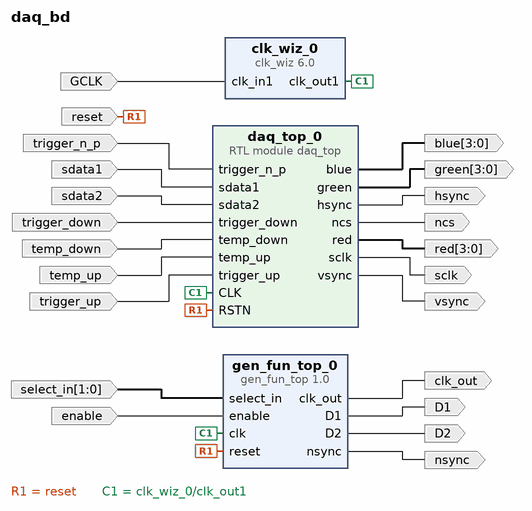
[diagram p0: block diagram of the top level]
# Vivado block design daq_bd, xc7z020clg484-1, Vivado 2020.2
create_bd_design daq_bd

create_bd_port -dir I sdata1
create_bd_port -dir I sdata2
create_bd_port -dir O ncs
create_bd_port -dir O sclk
create_bd_port -dir O nsync
create_bd_port -dir O D1
create_bd_port -dir O D2
create_bd_port -dir O clk_out
create_bd_port -dir O -from 3 -to 0 red
create_bd_port -dir O -from 3 -to 0 green
create_bd_port -dir O -from 3 -to 0 blue
create_bd_port -dir O hsync
create_bd_port -dir O vsync
create_bd_port -dir I trigger_n_p
create_bd_port -dir I trigger_down
create_bd_port -dir I temp_down
create_bd_port -dir I temp_up
create_bd_port -dir I trigger_up
create_bd_port -dir I reset
create_bd_port -dir I enable
create_bd_port -dir I -from 1 -to 0 select_in
create_bd_port -dir I GCLK

create_bd_cell -type ip -vlnv xilinx.com:ip:clk_wiz:6.0 clk_wiz_0
set_property -dict [list \
  CONFIG.CLKOUT1_JITTER 127.691 \
  CONFIG.CLKOUT1_PHASE_ERROR 97.646 \
  CONFIG.CLKOUT1_REQUESTED_OUT_FREQ 108.000 \
  CONFIG.MMCM_CLKFBOUT_MULT_F 10.125 \
  CONFIG.MMCM_CLKOUT0_DIVIDE_F 9.375 \
  CONFIG.USE_LOCKED false \
  CONFIG.USE_RESET false \
] [get_bd_cells clk_wiz_0]
create_bd_cell -type ip -vlnv xilinx.com:user:gen_fun_top:1.0 gen_fun_top_0
create_bd_cell -type module -reference daq_top daq_top_0

# ---- connections ----

connect_bd_net [get_bd_ports select_in] [get_bd_pins gen_fun_top_0/select_in]
connect_bd_net [get_bd_ports enable] [get_bd_pins gen_fun_top_0/enable]
connect_bd_net [get_bd_ports reset] [get_bd_pins gen_fun_top_0/reset] [get_bd_pins daq_top_0/RSTN]
connect_bd_net [get_bd_pins clk_wiz_0/clk_out1] [get_bd_pins gen_fun_top_0/clk] [get_bd_pins daq_top_0/CLK]
connect_bd_net [get_bd_pins gen_fun_top_0/clk_out] [get_bd_ports clk_out]
connect_bd_net [get_bd_pins gen_fun_top_0/nsync] [get_bd_ports nsync]
connect_bd_net [get_bd_pins gen_fun_top_0/D1] [get_bd_ports D1]
connect_bd_net [get_bd_pins gen_fun_top_0/D2] [get_bd_ports D2]
connect_bd_net [get_bd_ports trigger_n_p] [get_bd_pins daq_top_0/trigger_n_p]
connect_bd_net -net sdata1_1 [get_bd_ports sdata1] [get_bd_pins daq_top_0/sdata1]
connect_bd_net -net sdata2_1 [get_bd_ports sdata2] [get_bd_pins daq_top_0/sdata2]
connect_bd_net [get_bd_ports trigger_down] [get_bd_pins daq_top_0/trigger_down]
connect_bd_net [get_bd_ports temp_down] [get_bd_pins daq_top_0/temp_down]
connect_bd_net [get_bd_ports temp_up] [get_bd_pins daq_top_0/temp_up]
connect_bd_net [get_bd_ports trigger_up] [get_bd_pins daq_top_0/trigger_up]
connect_bd_net [get_bd_pins daq_top_0/ncs] [get_bd_ports ncs]
connect_bd_net [get_bd_pins daq_top_0/sclk] [get_bd_ports sclk]
connect_bd_net [get_bd_pins daq_top_0/hsync] [get_bd_ports hsync]
connect_bd_net [get_bd_pins daq_top_0/vsync] [get_bd_ports vsync]
connect_bd_net [get_bd_pins daq_top_0/red] [get_bd_ports red]
connect_bd_net [get_bd_pins daq_top_0/green] [get_bd_ports green]
connect_bd_net [get_bd_pins daq_top_0/blue] [get_bd_ports blue]
connect_bd_net [get_bd_ports GCLK] [get_bd_pins clk_wiz_0/clk_in1]

validate_bd_design
save_bd_design
